# EAGLE design haasoscope_pro_preinput_board (EAGLE 9.6.2)
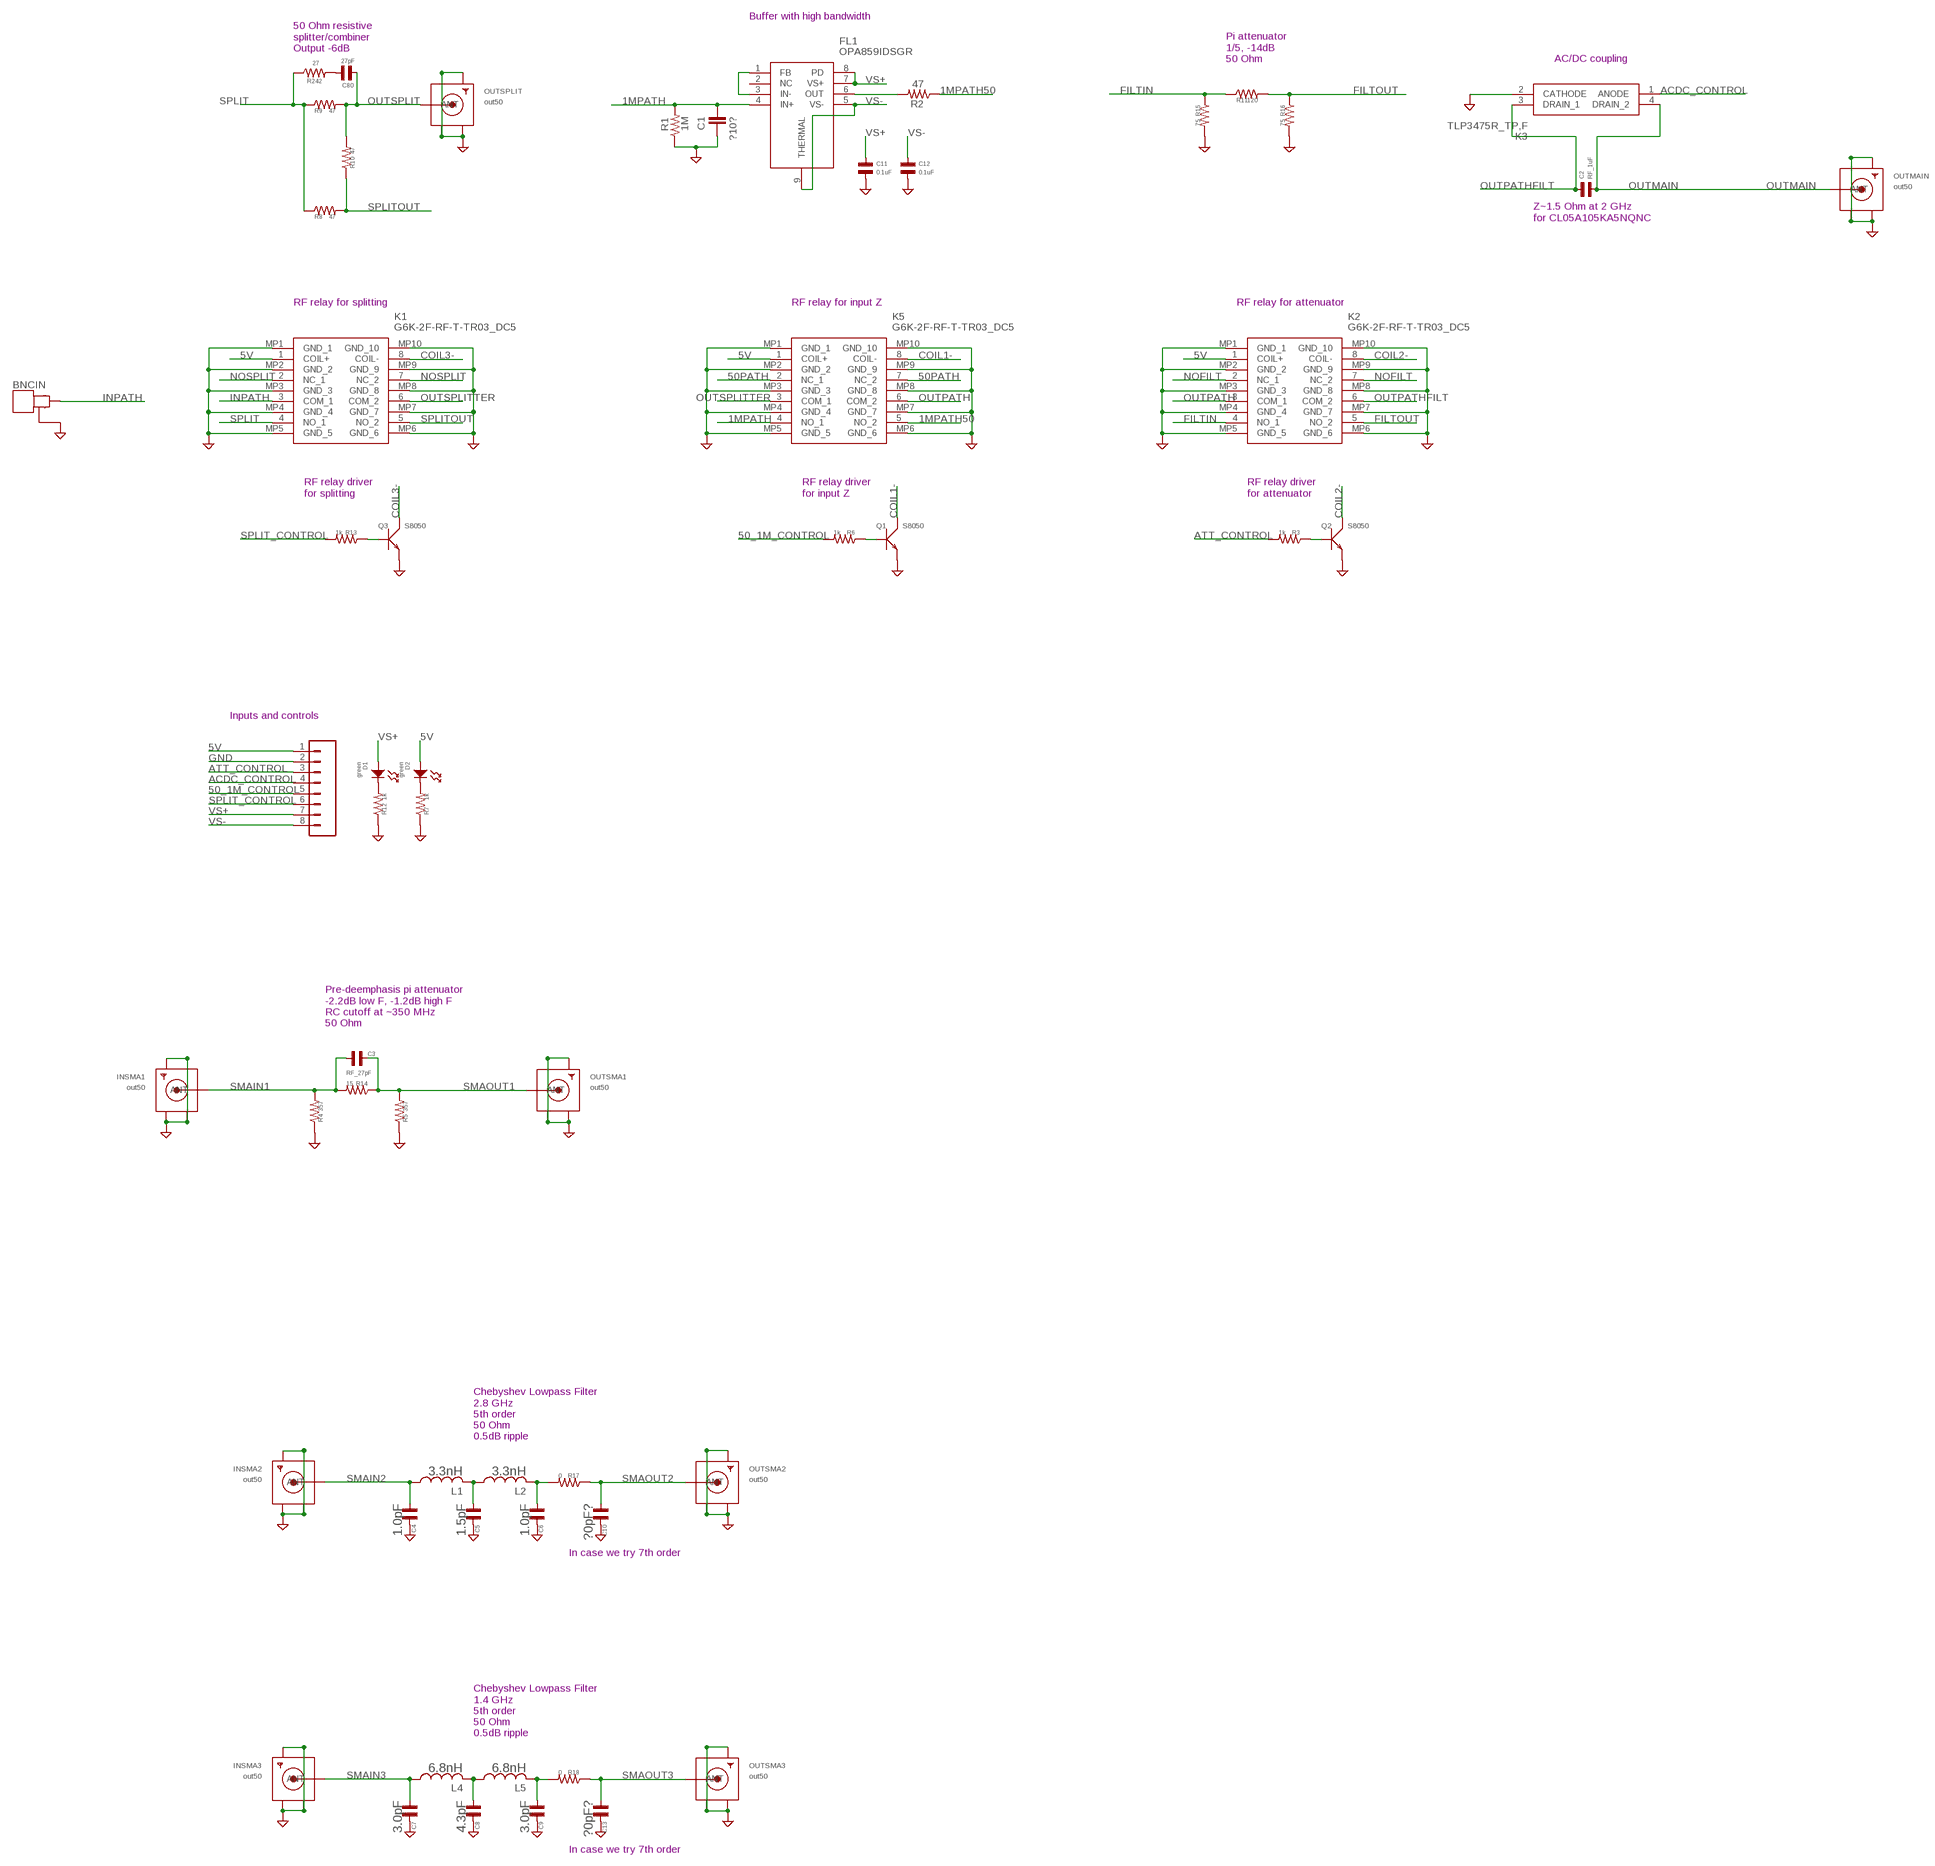
[diagram p0: schematic, sheet 1]

## Parts
BNCIN  MOLEX_BNC_73100-0105  [MOLEX-BNC-73100-0105]
C1  ?10?  C-EUC0805  [C0805]
C2  RF_1uF  CAPACITOR_NP_0402  [C0402]
C3  RF_27pF  CAPACITOR_NP_0402  [C0402]
C4  1.0pF  CAPACITOR_NP_0402  [C0402]
C5  1.5pF  CAPACITOR_NP_0402  [C0402]
C6  1.0pF  CAPACITOR_NP_0402  [C0402]
C7  3.0pF  CAPACITOR_NP_0402  [C0402]
C8  4.3pF  CAPACITOR_NP_0402  [C0402]
C9  3.0pF  CAPACITOR_NP_0402  [C0402]
C10  ?0pF?  CAPACITOR_NP_0402  [C0402]
C11  0.1uF  CAPACITOR_NP_0402  [C0402]
C12  0.1uF  CAPACITOR_NP_0402  [C0402]
C13  ?0pF?  CAPACITOR_NP_0402  [C0402]
C80  27pF  CAPACITOR_NP_0402  [C0402]
D1  green  LED_SINGLE-0603  [LED0603]
D2  green  LED_SINGLE-0603  [LED0603]
FL1  OPA859IDSGR  [SON50P200X200X80-9N]
INSMA1  out50  SMACONNECTOR_EDGE  [SMA_EDGELAUNCH]
INSMA2  out50  SMACONNECTOR_EDGE  [SMA_EDGELAUNCH]
INSMA3  out50  SMACONNECTOR_EDGE  [SMA_EDGELAUNCH]
J4  8pin  CONN_08"  [1X08]
K1  G6K-2F-RF-T-TR03_DC5  [G6K2FRFTTR03DC5]
K2  G6K-2F-RF-T-TR03_DC5  [G6K2FRFTTR03DC5]
K3  TLP3475R_TP,F  [TLP3475RTPF]
K5  G6K-2F-RF-T-TR03_DC5  [G6K2FRFTTR03DC5]
L1  3.3nH  INDUCTOR_0402_N  [RESC0402_N]
L2  3.3nH  INDUCTOR_0402_N  [RESC0402_N]
L4  6.8nH  INDUCTOR_0402_N  [RESC0402_N]
L5  6.8nH  INDUCTOR_0402_N  [RESC0402_N]
OUTMAIN  out50  SMACONNECTOR_EDGE  [SMA_EDGELAUNCH]
OUTSMA1  out50  SMACONNECTOR_EDGE  [SMA_EDGELAUNCH]
OUTSMA2  out50  SMACONNECTOR_EDGE  [SMA_EDGELAUNCH]
OUTSMA3  out50  SMACONNECTOR_EDGE  [SMA_EDGELAUNCH]
OUTSPLIT  out50  SMACONNECTOR_EDGE  [SMA_EDGELAUNCH]
Q1  S8050  SMD-TRANSISTORS-NPN-25V-500MW-S8050(SOT-23)  [SOT-23]
Q2  S8050  SMD-TRANSISTORS-NPN-25V-500MW-S8050(SOT-23)  [SOT-23]
Q3  S8050  SMD-TRANSISTORS-NPN-25V-500MW-S8050(SOT-23)  [SOT-23]
R1  1M  R-US_R0805  [R0805]
R2  47  R-US_R0805  [R0805]
R3  1k  RESISTOR_0402  [R0402]
R4  357  RESISTOR_0402  [R0402]
R5  357  RESISTOR_0402  [R0402]
R6  1k  RESISTOR_0402  [R0402]
R7  1k  RESISTOR_0402  [R0402]
R8  47  RESISTOR_0402  [R0402]
R9  47  RESISTOR_0402  [R0402]
R10  47  RESISTOR_0402  [R0402]
R11  120  RESISTOR_0402  [R0402]
R12  1k  RESISTOR_0402  [R0402]
R13  1k  RESISTOR_0402  [R0402]
R14  15  RESISTOR_0402  [R0402]
R15  75  RESISTOR_0402  [R0402]
R16  75  RESISTOR_0402  [R0402]
R17  0  RESISTOR_0402  [R0402]
R18  0  RESISTOR_0402  [R0402]
R242  27  RESISTOR_0402  [R0402]

## Nets
1MPATH: C1.2 FL1.4(IN+) K5.4(NO_1) R1.2
1MPATH50: K5.5(NO_2) R2.1
5V: D2.ANODE J4.1 K1.1(COIL+) K2.1(COIL+) K5.1(COIL+)
50_1M_CONTROL: J4.5 R6.P$2
50PATH: K5.2(NC_1) K5.7(NC_2)
ACDC_CONTROL: J4.4 K3.1(ANODE)
ATT_CONTROL: J4.3 R3.P$2
COIL1-: K5.8(COIL-) Q1.3(C)
COIL2-: K2.8(COIL-) Q2.3(C)
COIL3-: K1.8(COIL-) Q3.3(C)
FILTIN: K2.4(NO_1) R11.P$1 R15.P$1
FILTOUT: K2.5(NO_2) R11.P$2 R16.P$1
GND: BNCIN.GND1(GND) BNCIN.GND2(GND) C1.1 C4.P$2 C5.P$2 C6.P$2 C7.P$2 C8.P$2 C9.P$2 C10.P$2 C11.P$2 C12.P$2 C13.P$2 INSMA1.GND@1(GND4) INSMA1.GND@2(GND3) INSMA1.GND@3(GND2) INSMA1.GND@4(GND1) INSMA2.GND@1(GND4) INSMA2.GND@2(GND3) INSMA2.GND@3(GND2) INSMA2.GND@4(GND1) INSMA3.GND@1(GND4) INSMA3.GND@2(GND3) INSMA3.GND@3(GND2) INSMA3.GND@4(GND1) J4.2 K1.MP1(GND_1) K1.MP2(GND_2) K1.MP3(GND_3) K1.MP4(GND_4) K1.MP5(GND_5) K1.MP6(GND_6) K1.MP7(GND_7) K1.MP8(GND_8) K1.MP9(GND_9) K1.MP10(GND_10) K2.MP1(GND_1) K2.MP2(GND_2) K2.MP3(GND_3) K2.MP4(GND_4) K2.MP5(GND_5) K2.MP6(GND_6) K2.MP7(GND_7) K2.MP8(GND_8) K2.MP9(GND_9) K2.MP10(GND_10) K3.2(CATHODE) K5.MP1(GND_1) K5.MP2(GND_2) K5.MP3(GND_3) K5.MP4(GND_4) K5.MP5(GND_5) K5.MP6(GND_6) K5.MP7(GND_7) K5.MP8(GND_8) K5.MP9(GND_9) K5.MP10(GND_10) OUTMAIN.GND@1(GND4) OUTMAIN.GND@2(GND3) OUTMAIN.GND@3(GND2) OUTMAIN.GND@4(GND1) OUTSMA1.GND@1(GND4) OUTSMA1.GND@2(GND3) OUTSMA1.GND@3(GND2) OUTSMA1.GND@4(GND1) OUTSMA2.GND@1(GND4) OUTSMA2.GND@2(GND3) OUTSMA2.GND@3(GND2) OUTSMA2.GND@4(GND1) OUTSMA3.GND@1(GND4) OUTSMA3.GND@2(GND3) OUTSMA3.GND@3(GND2) OUTSMA3.GND@4(GND1) OUTSPLIT.GND@1(GND4) OUTSPLIT.GND@2(GND3) OUTSPLIT.GND@3(GND2) OUTSPLIT.GND@4(GND1) Q1.2(E) Q2.2(E) Q3.2(E) R1.1 R4.P$1 R5.P$1 R7.P$1 R12.P$1 R15.P$2 R16.P$2
INPATH: BNCIN.SIGNAL K1.3(COM_1)
N$1: D1.CATHODE R12.P$2
N$2: Q2.1(B) R3.P$1
N$3: Q3.1(B) R13.P$1
N$4: FL1.6(OUT) R2.2
N$5: FL1.1(FB) FL1.3(IN-)
N$6: Q1.1(B) R6.P$1
N$7: D2.CATHODE R7.P$2
N$8: C5.P$1 L1.2 L2.1
N$9: C6.P$1 L2.2 R17.P$2
N$10: C8.P$1 L4.2 L5.1
N$11: C9.P$1 L5.2 R18.P$2
N$67: C80.P$1 R242.P$2
NOFILT: K2.2(NC_1) K2.7(NC_2)
NOSPLIT: K1.2(NC_1) K1.7(NC_2)
OUTMAIN: C2.P$2 K3.4(DRAIN_2) OUTMAIN.P(ANT)
OUTPATH: K2.3(COM_1) K5.6(COM_2)
OUTPATHFILT: C2.P$1 K2.6(COM_2) K3.3(DRAIN_1)
OUTSPLIT: C80.P$2 OUTSPLIT.P(ANT) R9.P$2 R10.P$2
OUTSPLITTER: K1.6(COM_2) K5.3(COM_1)
SMAIN1: C3.P$1 INSMA1.P(ANT) R4.P$2 R14.P$2
SMAIN2: C4.P$1 INSMA2.P(ANT) L1.1
SMAIN3: C7.P$1 INSMA3.P(ANT) L4.1
SMAOUT1: C3.P$2 OUTSMA1.P(ANT) R5.P$2 R14.P$1
SMAOUT2: C10.P$1 OUTSMA2.P(ANT) R17.P$1
SMAOUT3: C13.P$1 OUTSMA3.P(ANT) R18.P$1
SPLIT: K1.4(NO_1) R8.P$1 R9.P$1 R242.P$1
SPLIT_CONTROL: J4.6 R13.P$2
SPLITOUT: K1.5(NO_2) R8.P$2 R10.P$1
VS+: C11.P$1 D1.ANODE FL1.7(VS+) FL1.8(PD) J4.7
VS-: C12.P$1 FL1.5(VS-) FL1.9(THERMAL) J4.8
Unconnected: FL1.2(NC)

## Notes on the sheet
- Buffer with high bandwidth
- 50 Ohm resistive 
  splitter/combiner
  Output -6dB
- Pi attenuator
  1/5, -14dB
  50 Ohm
- AC/DC coupling
- Z~1.5 Ohm at 2 GHz
  for CL05A105KA5NQNC
- RF relay for splitting | RF relay for input Z | RF relay for attenuator
- RF relay driver
  for splitting
- RF relay driver
  for input Z
- RF relay driver
  for attenuator
- Inputs and controls
- Pre-deemphasis pi attenuator
  -2.2dB low F, -1.2dB high F
  RC cutoff at ~350 MHz
  50 Ohm
- Chebyshev Lowpass Filter
  2.8 GHz
  5th order
  50 Ohm
  0.5dB ripple
- In case we try 7th order
- Chebyshev Lowpass Filter
  1.4 GHz
  5th order
  50 Ohm
  0.5dB ripple
- In case we try 7th order

## Library data of the parts
BNCIN = connector:MOLEX_BNC_73100-0105: CONN BNC JACK R/A 50 OHM PCB; DIGIKEY: WM5524-ND; MPN: 73100-0105
C1 = resistor:C-EU: CAPACITOR, European symbol
C2-C10 C13 C80 = MF_Passives:CAPACITOR_NP: Library: MF_Passives Description: Device for Non-Polarized Capacitors. Manufacture part number (MPN) can be added via Attributes. Check https://factory.macrofab.com/parts for the house parts list.; LCSC: C52923; POPULATE: 1
C11 C12 = MF_Passives:CAPACITOR_NP: Library: MF_Passives Description: Device for Non-Polarized Capacitors. Manufacture part number (MPN) can be added via Attributes. Check https://factory.macrofab.com/parts for the house parts list.; POPULATE: 1
D1 D2 = MF_LEDs:LED_SINGLE: Library: MF_LEDs Description: Device for Single LED Packages. Manufacture part number (MFG#) can be added via Attributes.; HOUSEPART: NO; LCSC: C2286; POPULATE: 1
FL1 = OPA859IDSGR:OPA859IDSGR: 1.8 GHz Unity-Gain Bandwidth, 3.3 nV/Hz, FET Input Amplifier Source: Datasheet <http://www.ti.com/lit/gpn/opa859>; DESCRIPTION: 1.8 GHz Unity-Gain Bandwidth, 3.3 nV/Hz, FET Input Amplifier; HEIGHT: 0.8mm; MANUFACTURER_NAME: Texas Instruments; MANUFACTURER_PART_NUMBER: OPA859IDSGR; MOUSER_PART_NUMBER: 595-OPA859IDSGR; MOUSER_PRICE-STOCK: https://www.mouser.co.uk/ProductDetail/Texas-Instruments/OPA859IDSGR?qs=qSfuJ%252Bfl%2Fd54IFp3Wwx4ug%3D%3D
INSMA1-INSMA3 OUTMAIN OUTSMA1-OUTSMA3 OUTSPLIT = adafruit:SMACONNECTOR: SMA Connector 90° DIP SMA Connector, 50 Ohm (4UConnector: 07259)
J4 = SparkFun-Connectors:CONN_08: Multi connection point. Often used as Generic Header-pin footprint for 0.1 inch spaced/style header connections On any of the 0.1 inch spaced packages, you can populate with these: Break Away Headers - Straight <https://www.sparkfun.com/products/116> (PRT-00116) Break Away Male Headers - Right Angle <https://www.sparkfun.com/products/553> (PRT-00553) Female Headers <https://www.sparkfun.com/products/115> (PRT-00115) Break Away Headers - Machine Pin <https://www.sparkfun.com/products/117> (PRT-00117) Break Away Female Headers - Swiss Machine Pin <https://www.sparkfun.com/products/743> (PRT-00743) Arduino Stackable Header - 8 Pin <https://www.sparkfun.com/products/9279> (PRT-09279) For SCREWTERMINALS and SPRING TERMINALS visit here: Screw Terimnals on SparkFun.com <https://www.sparkfun.com/search/results?term=Screw+Terminals> (5mm/3.5mm/2.54mm spacing) This device is also useful as a general connection point to wire up your design to another part of your project. Our various solder wires solder well into these plated through hole pads. Hook-Up Wire - Assortment (Stranded, 22 AWG) <https://www.sparkfun.com/products/11375> (PRT-11375) Hook-Up Wire - Assortment (Solid Core, 22 AWG) <https://www.sparkfun.com/products/11367> (PRT-11367) View the entire wire category on our website here <https://www.sparkfun.com/categories/141> Special notes: Molex polarized connector foot print use with SKU : PRT-08231 with associated crimp pins and housings. 1MM SMD Version SKU: PRT-10208 NOTES ON THE VARIANTS LOCK and LOCK_LONGPADS... This footprint was designed to help hold the alignment of a through-hole component (i.e. 6-pin header) while soldering it into place. You may notice that each hole has been shifted either up or down by 0.005 of an inch from it's more standard position (which is a perfectly straight line). This slight alteration caused the pins (the squares in the middle) to touch the edges of the holes. Because they are alternating, it causes a "brace" to hold the component in place. 0.005 has proven to be the perfect amount of "off-center" position when using our standard breakaway headers. Although looks a little odd when you look at the bare footprint, once you have a header in there, the alteration is very hard to notice. Also,if you push a header all the way into place, it is covered up entirely on the bottom side.; PROD_ID: CONN-08438
K1 K2 K5 = G6K-2F-RF-T-TR03_DC5:G6K-2F-RF-T-TR03_DC5: High Frequency / RF Relays 3GHz SpSavGrd NoLtch DPDT 5DC 100mW TR300 Source: Datasheet <http://omronfs.omron.com/en_US/ecb/products/pdf/en-g6k_2f_rf.pdf>; DESCRIPTION: High Frequency / RF Relays 3GHz SpSavGrd NoLtch DPDT 5DC 100mW TR300; HEIGHT: 5.7mm; MANUFACTURER_NAME: Omron Electronics; MANUFACTURER_PART_NUMBER: G6K-2F-RF-T-TR03 DC5; MOUSER_PART_NUMBER: 653-G6K2FRFTTR03DC5; MOUSER_PRICE-STOCK: https://www.mouser.co.uk/ProductDetail/Omron-Electronics/G6K-2F-RF-T-TR03-DC5?qs=bR9%2Fh8%2FHa7Q3LGohyKHVjA%3D%3D
K3 = TLP3475R_TP_F:TLP3475R_TP,F: Solid State Relays - PCB Mount Photorelay Voff=40V Ion=0.12A Ron=14Ohm Source: Datasheet <https://toshiba.semicon-storage.com/info/docget.jsp?did=15250&prodName=TLP3475R>; DESCRIPTION: Solid State Relays - PCB Mount Photorelay Voff=40V Ion=0.12A Ron=14Ohm; HEIGHT: 1.4mm; MANUFACTURER_NAME: Toshiba; MANUFACTURER_PART_NUMBER: TLP3475R(TP,F; MOUSER_PART_NUMBER: 757-TLP3475RTPF; MOUSER_PRICE-STOCK: https://www.mouser.co.uk/ProductDetail/Toshiba/TLP3475RTPF?qs=bYcAidFZG4jqnlmzhh150Q%3D%3D
L1 L2 L4 L5 = Nordic_nRF:INDUCTOR: Generic chip inductor
Q1-Q3 = Seeed-Transistor:SMD-TRANSISTORS-NPN-25V-500MW-S8050(SOT-23): 305010017; LCSC: C7420370; MPN: S8050
R1 R2 = resistor:R-US_: RESISTOR, American symbol
R3-R18 R242 = MF_Passives:RESISTOR: Library: MF_Passives Description: Device for Resistors. Manufacture part number (MPN), Voltage, Tolerance, and Wattage Rating can be added via Attributes. Check https://factory.macrofab.com/parts for the house parts list.; POPULATE: 1

## Net classes
0 default: width 0.203 mm
1 power: width 0.152 mm
5 critical: width 0.12 mm, clearance 0.15 mm to class 0, clearance 0.15 mm to class 1, clearance 0.15 mm to class 2, clearance 0.15 mm to class 3, clearance 0.15 mm to class 4, clearance 0.15 mm

## Board
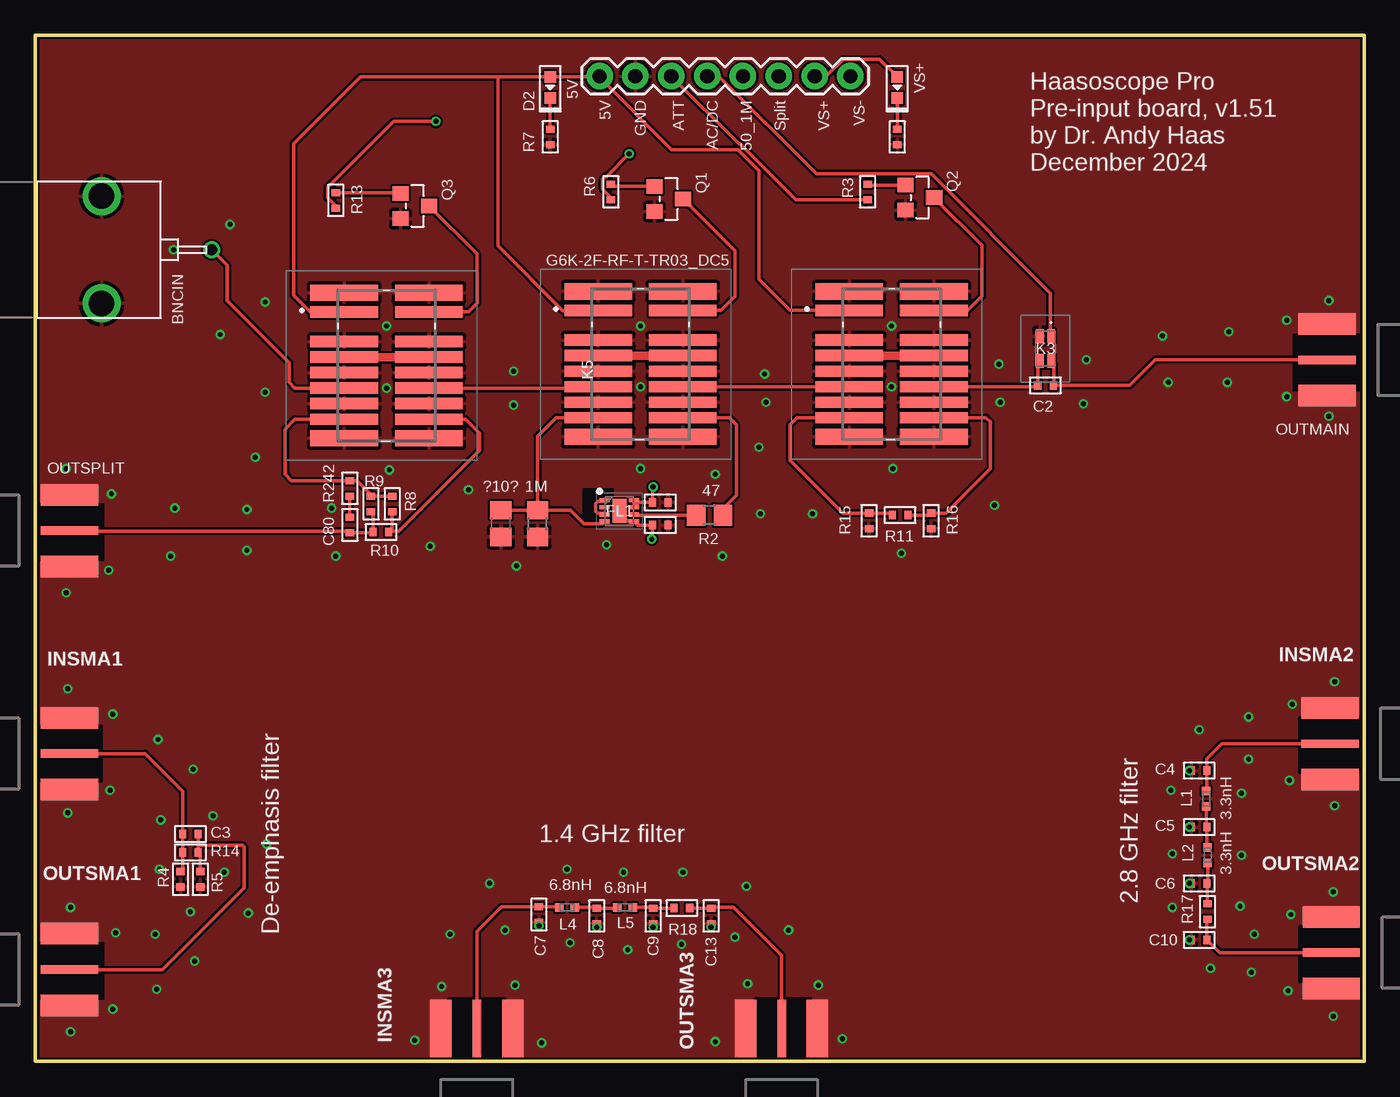
[diagram p1: board, top side]
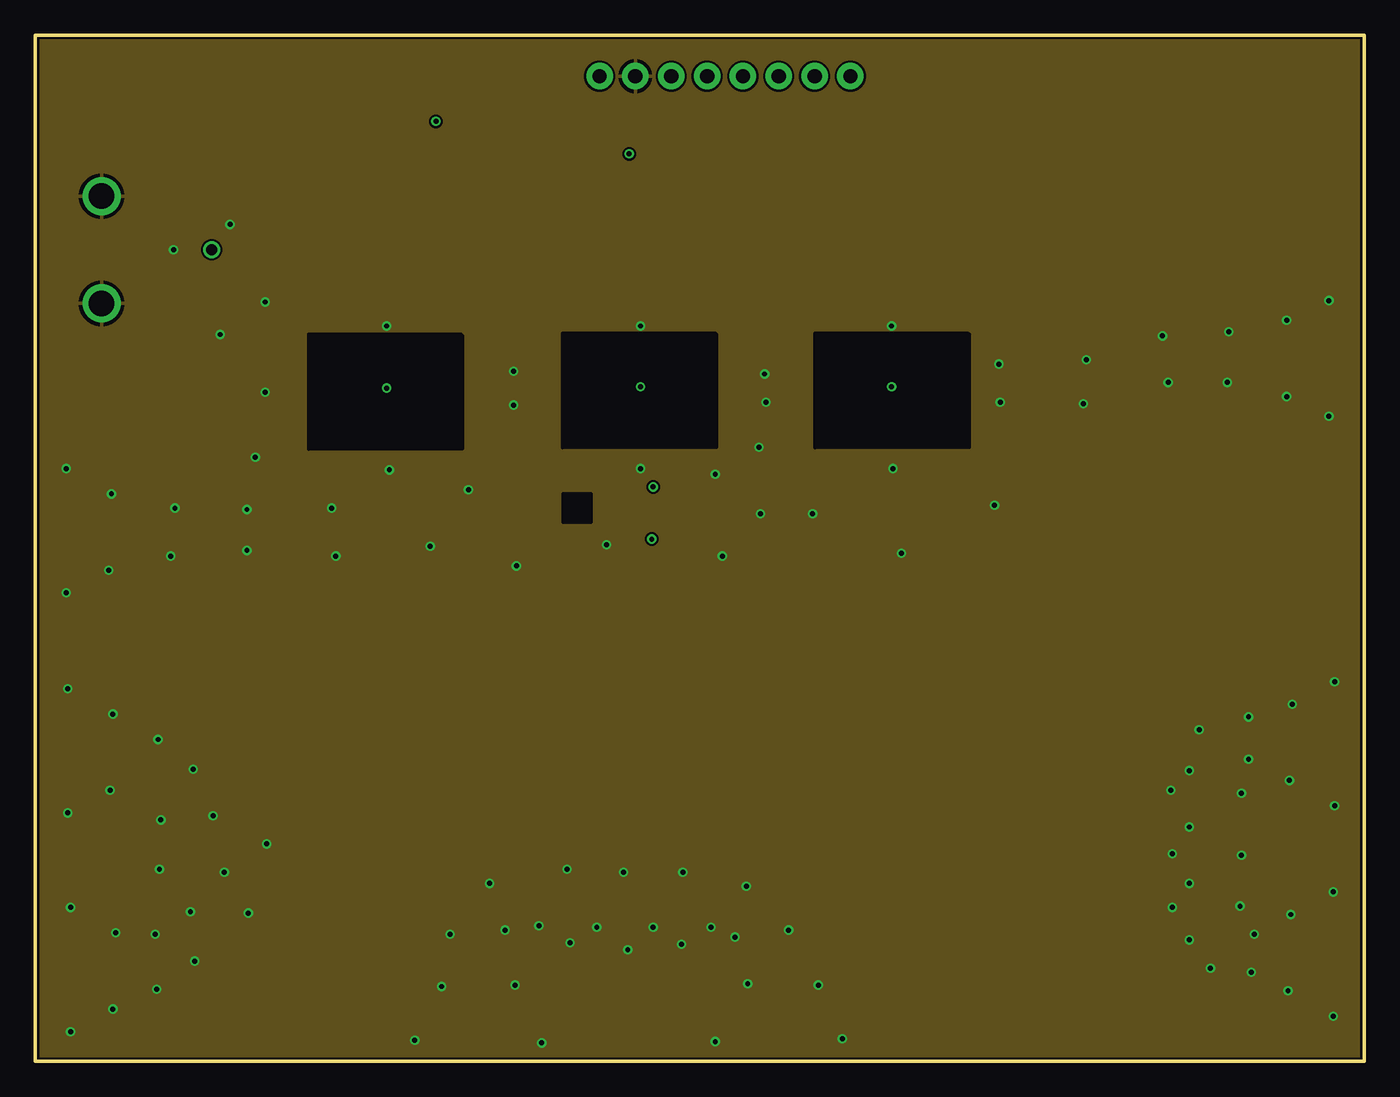
[diagram p2: board, inner layer topgnd]
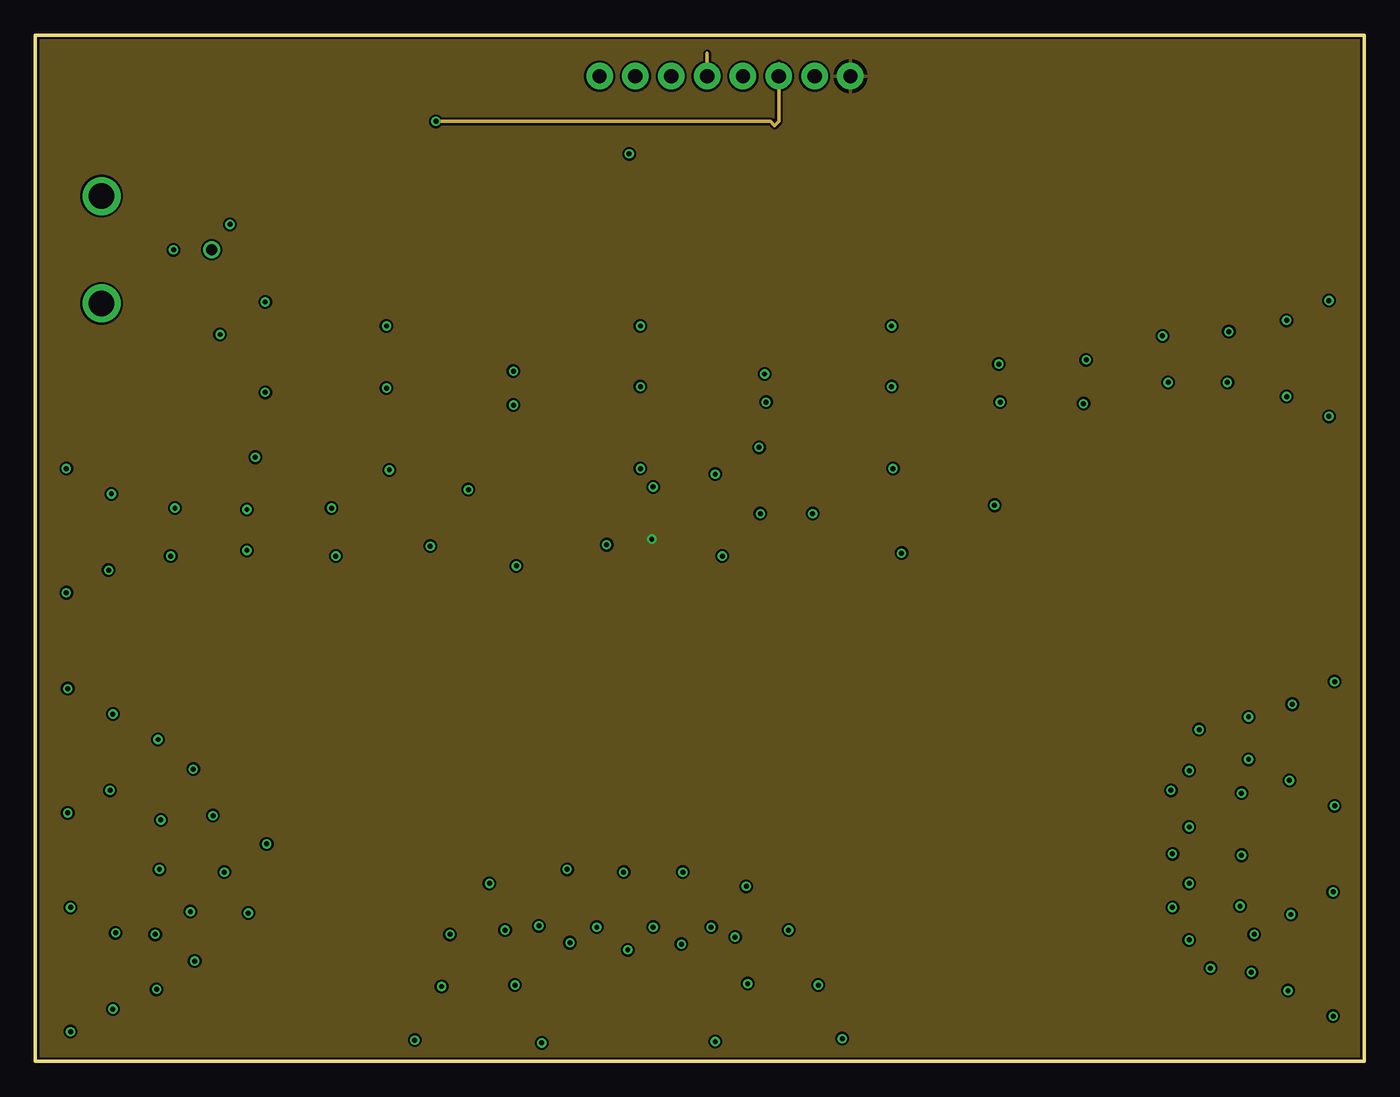
[diagram p3: board, inner layer vsmin]
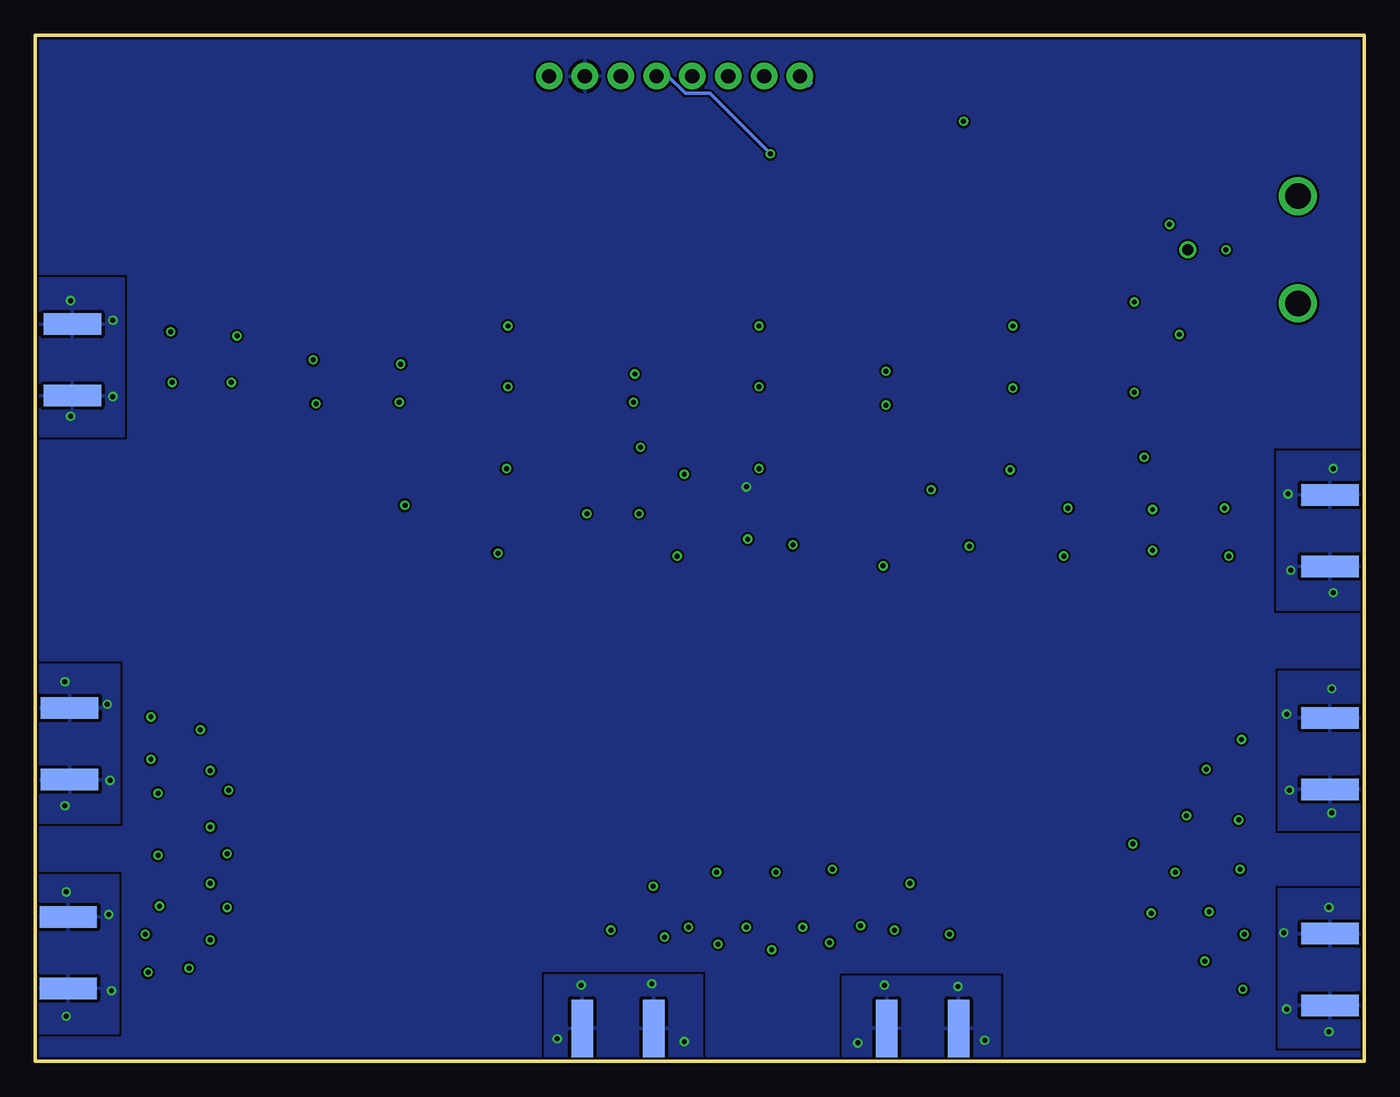
[diagram p4: board, bottom side, seen from below]

Size 94.2 x 72.7 mm. Coordinates in mm from the lower left corner, seen from the top.
Outline: 0,72.7 0,0 94.2,0 94.2,72.7 0,72.7
Copper layers (1*2*15*16): top 0.035mm / dielectric 0.2mm / topgnd 0.0175mm / dielectric 0.3mm / vsmin 0.0175mm / dielectric 0.2mm / vsplus 0.035mm
Design rules "Seeed_AllPCB_MacroFab_haas6mil *": minimum track width 6mil, minimum drill 12mil, track to track 6mil, track to pad 6mil, pad to pad 6mil, via to via 6mil, smd to smd 0mil, copper to edge 6mil, drill to drill 6mil, minimum pad ring 6mil, minimum via ring 6mil, stop-mask expansion 6mil, vias tented up to drill 25mil, thermal gap 10mil

### Footprints (pad centres in the part's own frame; a part is rotated, then mirrored left to right if it is on the bottom)
MOLEX-BNC-73100-0105 = drill 1.8: GND1 -3.8,-3.9; GND2 3.8,-3.9 | drill 0.8: SIGNAL 0,3.9
C0805 = smd 1.3 x 1.5: 1 -0.95,0; 2 0.95,0
C0402 = smd 0.5 x 0.6: P$1 -0.55,0; P$2 0.55,0
LED0603 = smd 0.8 x 0.8: ANODE 0.75,0; CATHODE -0.75,0
SON50P200X200X80-9N = smd 0.7 x 0.3: 1 -1.05,0.75; 2 -1.05,0.25; 3 -1.05,-0.25; 4 -1.05,-0.75; 5 1.05,-0.75; 6 1.05,-0.25; 7 1.05,0.25; 8 1.05,0.75 | smd 1 x 1.7: 9 0,0
SMA_EDGELAUNCH = smd 4.064 x 1.524: GND@1 2.032,-2.54; GND@2 2.032,2.54 | smd 4.064 x 1.524 bottom: GND@3 2.032,2.54; GND@4 2.032,-2.54 | smd 4.064 x 0.6: P 2.032,0
1X08 = drill 1.016 pad 1.88: 1 0,0; 2 2.54,0; 3 5.08,0; 4 7.62,0; 5 10.16,0; 6 12.7,0; 7 15.24,0; 8 17.78,0
G6K2FRFTTR03DC5 = smd 0.8 x 4.8: 1 -5.4,-3; 2 -2.2,-3; 3 0,-3; 4 2.2,-3; 5 2.2,3; 6 0,3; 7 -2.2,3; 8 -5.4,3; MP2 -3.3,-3; MP3 -1.1,-3; MP4 1.1,-3; MP7 1.1,3; MP8 -1.1,3; MP9 -3.3,3 | smd 1.15 x 4.8: MP1 -6.75,-3; MP5 3.55,-3; MP6 3.55,3; MP10 -6.75,3
TLP3475RTPF = smd 0.55 x 1: 1 -0.4,-0.875; 2 0.4,-0.875; 3 0.4,0.875; 4 -0.4,0.875
RESC0402_N = smd 0.6 x 0.6: 1 -0.55,0; 2 0.55,0
SOT-23 = smd 1.016 x 1.143: 1 -0.889,-1.016; 2 0.889,-1.016; 3 0,1.016
R0805 = smd 1.3 x 1.5: 1 -0.95,0; 2 0.95,0
R0402 = smd 0.5 x 0.6: P$1 -0.55,0; P$2 0.55,0

### Placement (x,y rotation side)
BNCIN  8.6,57.5 270 top
C1  33,38.1 90 top
C2  71.6,47.9 0 top
C3  11,16.1 0 top
C4  82.5,20.6 180 top
C5  82.5,16.6 180 top
C6  82.5,12.6 180 top
C7  35.7,10.4 270 top
C8  39.8,10.3 270 top
C9  43.8,10.3 270 top
C10  82.5,8.6 180 top
C11  44.3,39.6 0 top
C12  44.3,38 0 top
C13  47.9,10.3 270 top
C80  22.3,38 270 top
D1  61.1,69 90 top
D2  36.5,69 90 top
FL1  41.4,39 0 top
INSMA1  0.4,21.8 0 top
INSMA2  93.8,22.5 180 top
INSMA3  31.3,0.3 90 top
J4  40,69.8 0 top
K1  24.9,47.7 270 top
K2  60.7,47.8 270 top
K3  71.6,50.5 180 top
K5  42.9,47.8 270 top
L1  83,18.6 270 top
L2  83.1,14.6 270 top
L4  37.7,10.9 0 top
L5  41.8,10.9 0 top
OUTMAIN  93.6,49.7 180 top
OUTSMA1  0.4,6.5 0 top
OUTSMA2  93.9,7.7 180 top
OUTSMA3  52.9,0.3 90 top
OUTSPLIT  0.4,37.6 0 top
Q1  44.9,61.1 270 top
Q2  62.7,61.2 270 top
Q3  26.9,60.6 270 top
R1  35.6,38.1 90 top
R2  47.8,38.7 180 top
R3  59,61.6 270 top
R4  10.3,12.9 90 top
R5  11.7,12.9 90 top
R6  40.8,61.6 270 top
R7  36.5,65.5 90 top
R8  25.3,39.5 270 top
R9  23.8,39.5 270 top
R10  24.5,37.5 180 top
R11  61.3,38.7 0 top
R12  61.1,65.5 90 top
R13  21.3,61 270 top
R14  11,14.8 180 top
R15  59.1,38.3 270 top
R16  63.5,38.3 270 top
R17  83.08,10.6 90 top
R18  45.84,10.85 180 top
R242  22.3,40.6 270 top

### Tracks (layer width: path | path; a pad name or v marks a point on that pad's centre or on a via)
1MPATH
  top 0.254: FL1.4 40.2,38.1 38.9,38.1 37.95,39.05 R1.2 | R1.2 C1.2 | K5.4 36.9,45.6 35.6,44.3 R1.2
1MPATH50
  top 0.254: 48.1,39.35 R2.1 48.75,39.15 49.7,40.1 49.7,45.1 49.19,45.61 46.95,45.61 46.94,45.6 K5.5
5V
  top 0.254: 39.95,69.75 D2.ANODE 32.8,69.75 | 39.95,69.75 J4.1 | 37.6,53.2 K5.1 37.38,53.2 32.8,57.78 32.8,69.75 | K1.1 19.48,53.1 18.3,54.28 18.3,65 23.05,69.75 32.8,69.75 | K2.1 53.5,53.2 51.3,55.4 51.3,63.1 49.8,64.6 45.1,64.6 39.95,69.75
  vsplus 0.254: 40,70.6 40,69.9 J4.1
  vsplus 0.813: 39.5,69.4 40,69.9
50_1M_CONTROL  (via drill 0.35)
  top 0.254: v42.1,64.3 40.48,62.68 40.38,62.68 40.22,62.52 40.22,61.78 40.8,61.2 R6.P$2
  vsplus 0.254: v42.1,64.3 46.38,68.58 48.12,68.58 49.34,69.8 J4.5
50PATH
  top 0.254: K5.7 46.5,50
  top 0.61: K5.2 K5.7
ACDC_CONTROL
  top 0.254: K3.1 71.95,51.42 71.95,54.44 63.51,62.88 55.36,62.88 48.44,69.8 J4.4
  vsmin 0.254: 47.62,71.42 J4.4
ATT_CONTROL
  top 0.254: 58.85,60.9 R3.P$2 53.92,61.05 49.97,65.01 49.87,65.01 J4.3
  vsmin 0.254: 45.2,69.92 J4.3
COIL1-
  top 0.254: K5.8 48.6,53.2 49.6,54.2 49.6,57.42 Q1.3
COIL2-
  top 0.254: Q2.3 67.1,57.82 67.1,54.2 66.1,53.2 K2.8
COIL3-
  top 0.254: Q3.3 31.3,57.22 31.3,53.7 30.7,53.1 K1.8
FILTIN
  top 0.254: R11.P$1 60.6,38.85 R15.P$1 57.25,38.85 53.5,42.6 53.5,45.1 54,45.6 K2.4
FILTOUT
  top 0.254: R11.P$2 63.35,38.7 R16.P$1 64.55,38.85 67.7,42 67.7,45.3 67.4,45.6 K2.5
GND  (via drill 0.35)
  other vias: 5.2,34.8 2.2,33.2 5.4,40.2 2.2,42 88.7,47.1 91.7,45.7 88.7,52.5 91.7,53.9 33.9,48.9 51.7,48.7 33.9,46.5 51.8,46.7 68.3,49.4 68.4,46.7 13.1,51.5 16.3,47.4 8.8,13.6 16.3,53.8 13.8,59.3 24.9,52.1 42.9,52.1 60.7,52.1 60.7,47.8 42.9,47.8 24.9,47.7 30.7,40.5 25.1,41.9 42.9,42 60.8,42 21,39.2 28,36.5 21.3,35.8 15,39.1 15,36.2 9.9,39.2 9.6,35.8 15.6,42.8 51.4,38.8 34.1,35.1 40.5,36.6 48.7,35.8 48.2,41.6 51.3,43.5 55.1,38.8 61.4,36 68,39.4 74.3,46.6 74.5,49.7 79.9,51.4 80.3,48.1 84.6,51.7 84.5,48.1 9.8,57.5 11,10.6 13.4,13.4 8.9,17.1 12.6,17.4 16.4,15.4 15.1,10.5 11.3,7.1 8.6,5.1 8.5,9 11.2,20.7 8.7,22.8 89.1,25.3 92.1,26.9 88.9,19.9 92.1,18.1 89,10.4 92,12 88.8,5 92,3.2 80.6,10.9 85.4,11 85.5,14.6 80.6,14.7 80.5,19.2 85.5,19 82.5,23.5 5.3,19.2 2.3,17.6 5.5,24.6 2.3,26.4 5.5,3.7 2.5,2.1 5.7,9.1 2.5,10.9 57.2,1.6 55.5,5.4 50.5,5.5 48.2,1.4 35.9,1.3 34,5.4 28.8,5.3 26.9,1.5 32.2,12.6 29.4,9 33.3,9.3 37.7,13.6 41.7,13.4 45.9,13.4 42,7.9 37.9,8.4 50.4,12.4 53.4,9.3 49.6,8.8 83.3,6.6 35.7,9.6 39.8,9.5 43.8,9.5 47.9,9.5 81.8,20.6 81.8,16.6 81.8,12.6 81.8,8.6 86,24.4 86.2,6.3 86.4,9 86,21.4 45.8,8.3
  pour topgnd (isolate 0.152): 97.2,77.2 97.2,-3.2 -4,-3.2 -4,77.2
  pour top (isolate 0.152): -2,-1.7 -2,74.2 -1.5,74.7 95.2,74.7 95.7,74.2 95.7,-1.7
  cutout topgnd: 37.4,40.2 39.4,40.2 39.4,38.2 37.4,38.2
  cutout top: 38.9,40.5 40.9,40.5 40.9,38.5 38.9,38.5
  pour vsplus: 94.3,55.5 94.3,44.3 87.9,44.3 87.9,55.5
  pour vsplus: -0.2,32 -0.2,43.2 6.2,43.2 6.2,32
  cutout topgnd (isolate 0.16): 19.37,51.5 30.2,51.5 30.3,51.4 30.3,43.4 19.4,43.4 19.37,43.37
  cutout topgnd (isolate 0.16): 37.37,51.6 48.2,51.6 48.3,51.5 48.3,43.5 37.4,43.5 37.37,43.47
  cutout topgnd (isolate 0.16): 55.27,51.6 66.1,51.6 66.2,51.5 66.2,43.5 55.3,43.5 55.27,43.47
  pour vsplus: -0.3,1 -0.3,12.2 6.1,12.2 6.1,1
  pour vsplus: -0.3,16.4 -0.3,27.6 6.1,27.6 6.1,16.4
  pour vsplus: 88.2,16.9 88.2,28.1 94.6,28.1 94.6,16.9
  pour vsplus: 88.3,2 88.3,13.2 94.7,13.2 94.7,2
  pour vsplus: 37,-0.4 25.8,-0.4 25.8,6 37,6
  pour vsplus: 58.1,-0.3 46.9,-0.3 46.9,6.1 58.1,6.1
GND1
  cutout top (isolate 0.16): -0.2,39.5 4.8,39.5 4.8,35.5 -0.2,35.5
  cutout top (isolate 0.16): -0.2,8.4 4.8,8.4 4.8,4.4 -0.2,4.4
  cutout top (isolate 0.16): -0.3,23.8 4.7,23.8 4.7,19.8 -0.3,19.8
  cutout top (isolate 0.16): 89.6,24.4 94.6,24.4 94.6,20.4 89.6,20.4
  cutout top (isolate 0.16): 89.6,9.6 94.6,9.6 94.6,5.6 89.6,5.6
  cutout top (isolate 0.16): 29.3,-0.5 29.3,4.5 33.3,4.5 33.3,-0.5
  cutout top (isolate 0.16): 51,-0.5 51,4.5 55,4.5 55,-0.5
  cutout top (isolate 0.16): 89.2,51.5 94.2,51.5 94.2,47.5 89.2,47.5
INPATH
  top 0.254: 21.88,47.72 K1.3 18.4,47.7 18,48.1 18,49.5 13.6,53.9 13.6,56.4 BNCIN.SIGNAL
N$1
  top 0.254: D1.CATHODE R12.P$2
N$2
  top 0.254: Q2.1 59.06,62.09 R3.P$1
N$3
  top 0.254: R13.P$1 25.82,61.55 Q3.1
N$4
  top 0.254: FL1.6 42.5,38.7 R2.2
N$5
  top 0.254: FL1.1 40.28,39.68 39.88,39.68 39.72,39.52 39.72,38.98 39.88,38.82 40.28,38.82 FL1.3
N$6
  top 0.254: Q1.1 40.96,61.99 R6.P$1
N$7
  top 0.254: D2.CATHODE R7.P$2
N$8
  top 0.254: L1.2 83,16.65 C5.P$1 83.05,15.2 L2.1
N$9
  top 0.254: L2.2 83.1,12.65 C6.P$1 | C6.P$1 83.2,12.45 | 83.1,12.55 C6.P$1 | R17.P$2 83.08,12.57 C6.P$1
N$10
  top 0.254: L4.2 39.75,10.9 C8.P$1 41.2,10.85 L5.1
N$11
  top 0.254: L5.2 43.75,10.9 C9.P$1 | C9.P$1 43.85,10.9 | R18.P$2 C9.P$1
N$67
  top 0.254: R242.P$2 C80.P$1
NOFILT
  top 0.61: K2.2 K2.7
NOSPLIT
  top 0.61: K1.2 K1.7
OUTMAIN
  top 0.254: K3.4 72.2,49.42 72.2,47.95 C2.P$2 77.59,47.9 79.38,49.7 OUTMAIN.P
OUTPATH
  top 0.254: 45.3,47.8 K5.6 K2.3
OUTPATHFILT
  top 0.254: K3.3 71.05,49.47 C2.P$1 70.95,47.8 K2.6
OUTSPLIT
  top 0.254: R9.P$2 23.95,38.8 R10.P$2 23.9,37.45 C80.P$2 22.2,37.55 2.48,37.55 OUTSPLIT.P 2,37.6 1.9,37.5
OUTSPLITTER
  top 0.254: K1.6 39.8,47.7 K5.3
SMAIN1
  top 0.254: 10.3,16.25 C3.P$1 | C3.P$1 10.45,15.9 R14.P$2 10.45,13.6 R4.P$2 | INSMA1.P 7.8,21.8 10.45,19.15 C3.P$1
SMAIN2
  top 0.254: L1.1 83.05,19.2 C4.P$1 83.05,21.45 84.1,22.5 INSMA2.P
SMAIN3
  top 0.254: INSMA3.P 31.3,9.2 33.05,10.95 C7.P$1 37.1,10.95 L4.1
SMAOUT1
  top 0.254: C3.P$2 11.55,15.3 | 11.55,15.3 R14.P$1 11.7,14.65 R5.P$2 | OUTSMA1.P 9,6.5 14.8,12.3 14.8,15.2 14.7,15.3 11.55,15.3
SMAOUT2
  top 0.254: C10.P$1 83.95,7.7 OUTSMA2.P | C10.P$1 83.05,10 | C10.P$1 83.05,10.02 R17.P$1
SMAOUT3
  top 0.254: OUTSMA3.P 52.9,7.5 49.5,10.9 47.95,10.9 C13.P$1 R18.P$1
SPLIT
  top 0.254: R8.P$1 23.9,40.05 | 23.9,40.05 R9.P$1 | K1.4 18.4,45.5 17.7,44.8 17.7,41.6 18.15,41.15 R242.P$1 22.8,41.15 23.9,40.05
SPLIT_CONTROL  (via drill 0.35)
  top 0.254: v28.4,66.6 25.4,66.6 20.72,61.92 20.72,61.18 21.3,60.61 R13.P$2
  vsmin 0.254: 52.7,70.7 J4.6 52.7,66.6 52.4,66.3 52.1,66.6 v28.4,66.6
SPLITOUT
  top 0.254: R8.P$2 25.3,37.75 25.1,37.55 | 25.1,37.55 R10.P$1 | K1.5 30.5,45.5 31.5,44.5 31.5,43.3 25.75,37.55 25.1,37.55
VS+  (via drill 0.35)
  top 0.254: J4.7 56.06,69.8 57.28,71.02 59.83,71.02 D1.ANODE | C11.P$1 43.75,40.45 43.8,40.5 v43.8,40.7 | C11.P$1 42.6,39.6 FL1.8 FL1.7 42.8,39.6 C11.P$1
  pour vsplus (isolate 0.152, rank 2): -1,73.7 95.2,74.1 95.2,-2.4 -1,-2.4
VS-  (via drill 0.35)
  top 0.254: v43.7,37 43.75,37.05 C12.P$1 42.7,38 FL1.5 42.05,38.25 41.82,38.48 41.82,38.58 FL1.9
  pour vsmin (isolate 0.152, rank 2): -3,76.2 96.2,76.6 96.2,-1 -3,-1

### Text on the board
tPlace: 5V | VS+ | 5V | GND | ATT | AC/DC | 50_1M | Split | VS+ | VS- | Haasoscope Pro / Pre-input board, v1.51 / by Dr. Andy Haas / December 2024 | 2.8 GHz filter | 1.4 GHz filter | De-emphasis filter